# Altium schematic sheet phase-shifters.SchDoc
size 420 x 297 mm; SheetNumber: 3; SheetTotal: 7
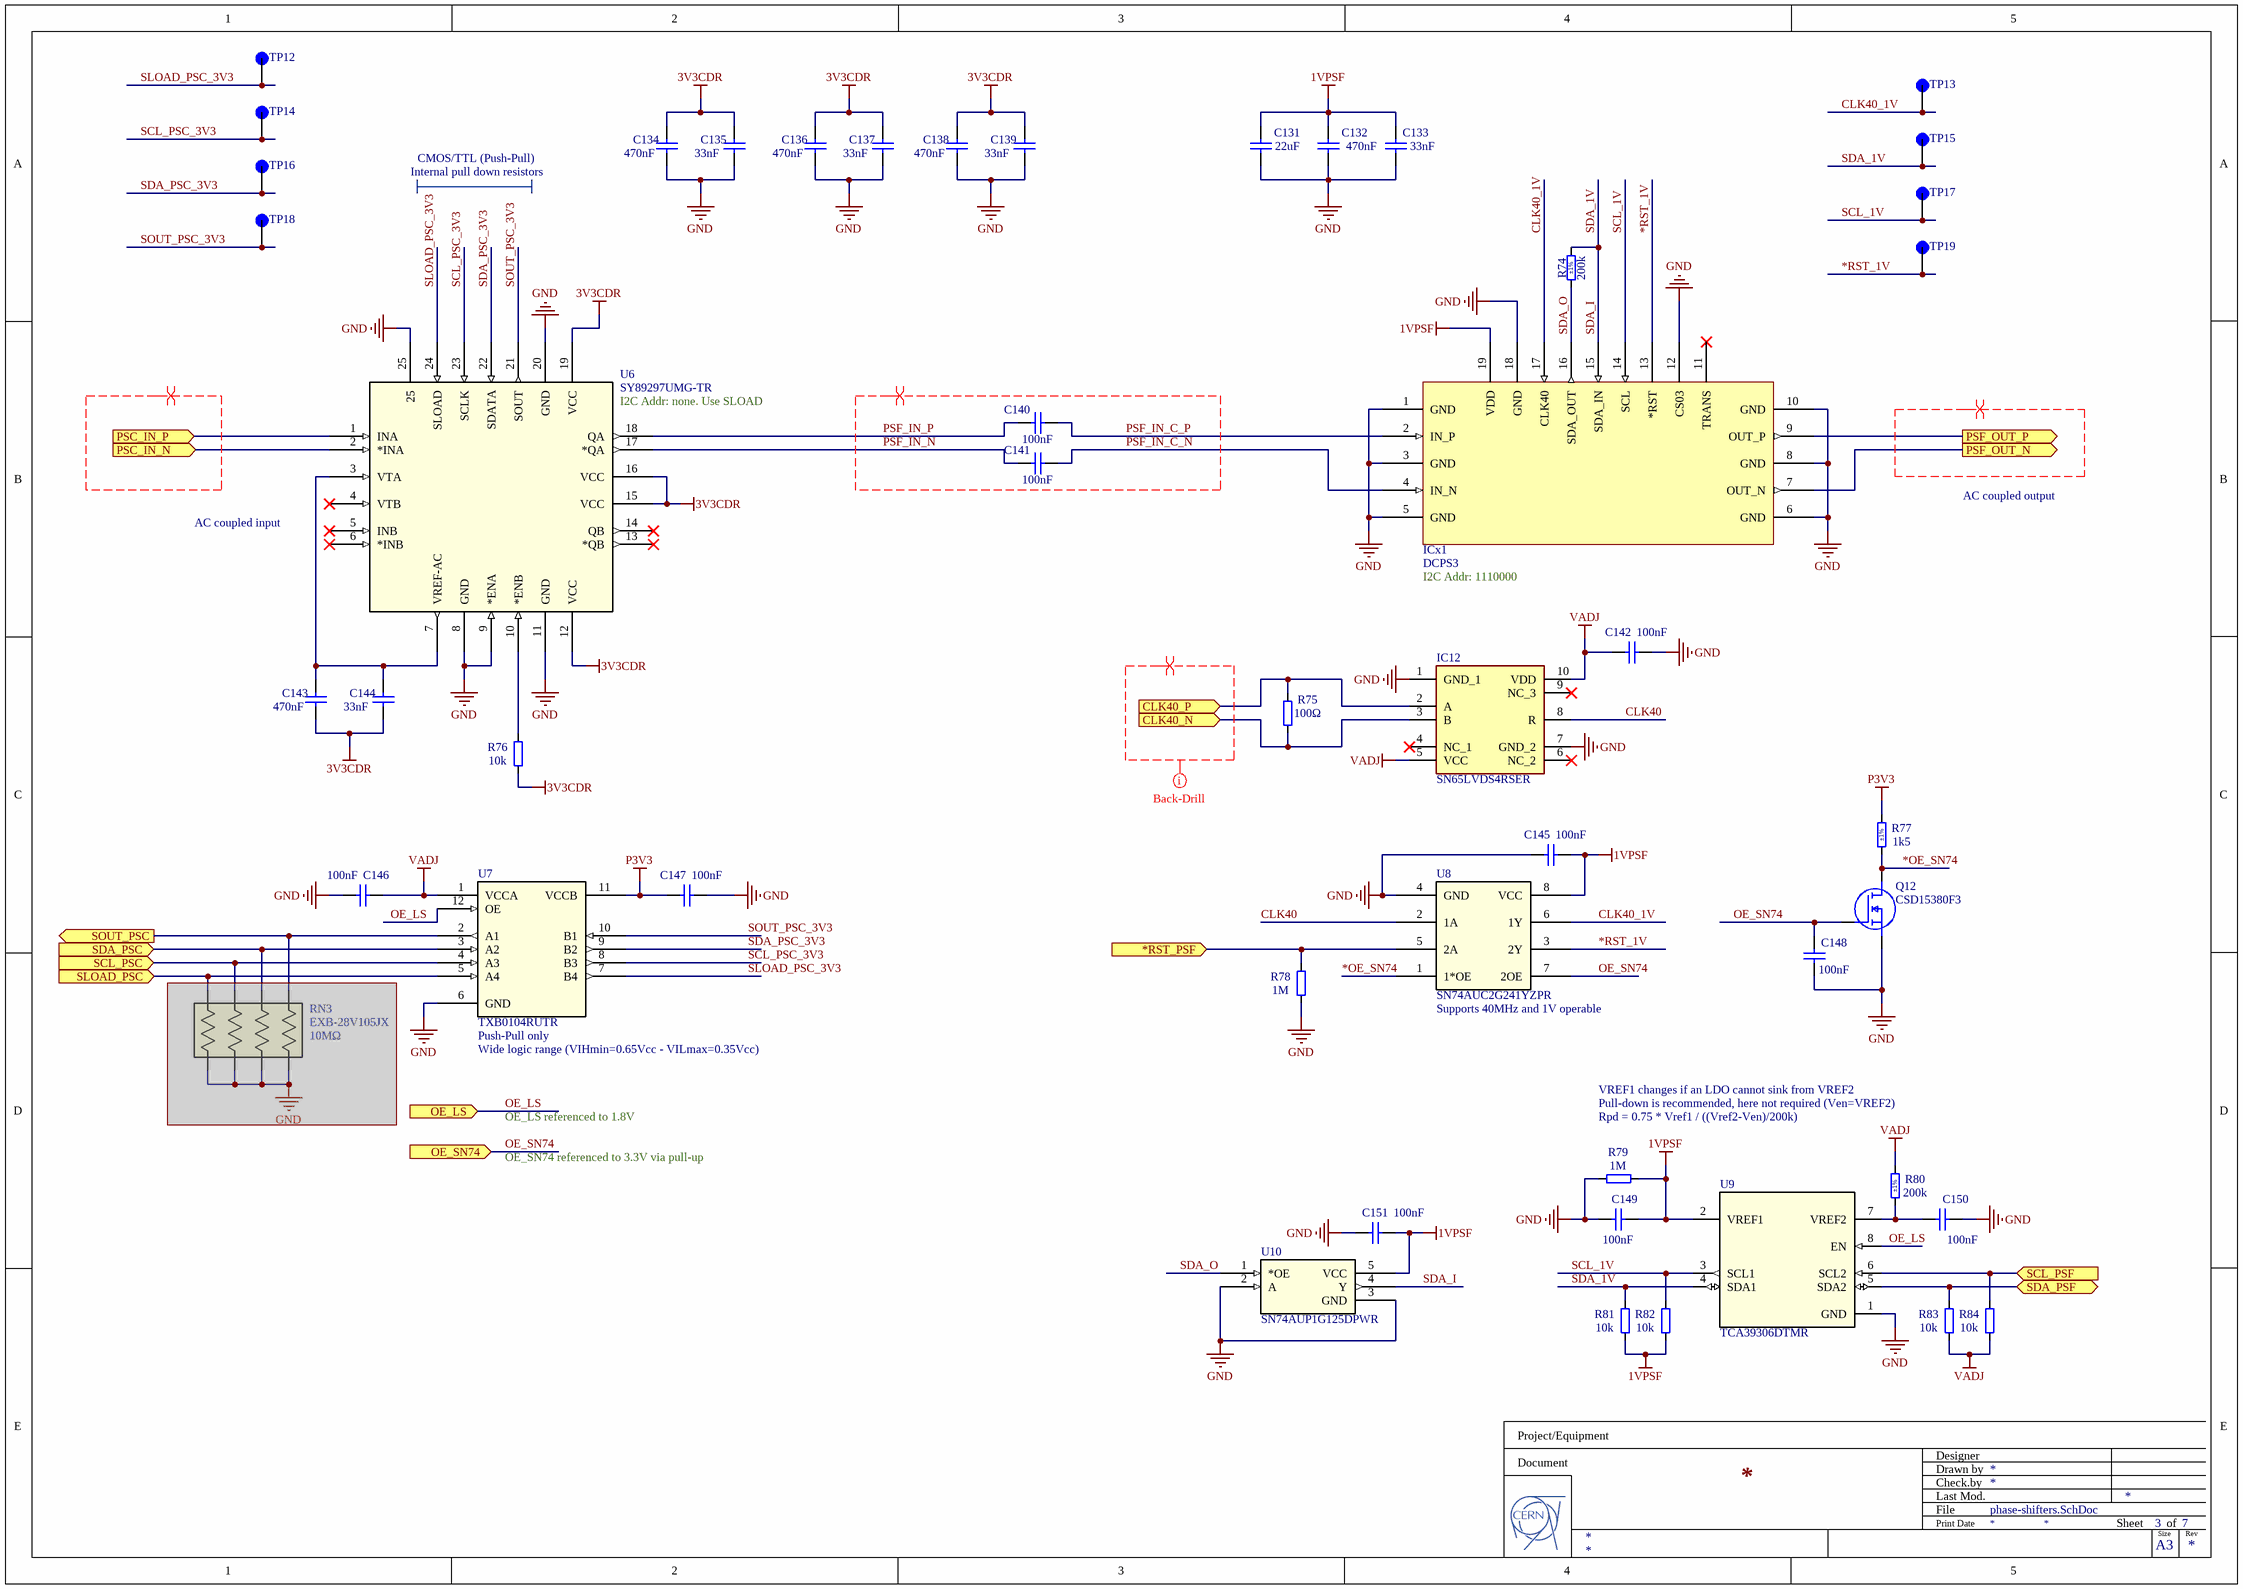
[diagram p0: phase-shifters.SchDoc]

## Parts
C131  22uF  [MURATA_HI_DENSITY_0402_CAP]
C132  470nF  [CAPC0510X04N]
C133  33nF  [LLL03TR61E333KE01]
C134  470nF  [CAPC0510X04N]
C135  33nF  [LLL03TR61E333KE01]
C136  470nF  [CAPC0510X04N]
C137  33nF  [LLL03TR61E333KE01]
C138  470nF  [CAPC0510X04N]
C139  33nF  [LLL03TR61E333KE01]
C140  100nF  [MURATA_HI_DENSITY_0201]
C141  100nF  [MURATA_HI_DENSITY_0201]
C142  100nF  [MURATA_HI_DENSITY_0201]
C143  470nF  [CAPC0510X04N]
C144  33nF  [LLL03TR61E333KE01]
C145  100nF  [MURATA_HI_DENSITY_0201]
C146  100nF  [MURATA_HI_DENSITY_0201]
C147  100nF  [MURATA_HI_DENSITY_0201]
C148  100nF  [MURATA_HI_DENSITY_0201]
C149  100nF  [MURATA_HI_DENSITY_0201]
C150  100nF  [MURATA_HI_DENSITY_0201]
C151  100nF  [MURATA_HI_DENSITY_0201]
IC12  SN65LVDS4RSER  [SN65LVDS4RSER]
ICx1  DCPS3  [DCPS3-Large]
Q12  CSD15380F3  [CSD15380F3]
R74  200k  Tolerance: ±1%  [RESC1005X40N]
R75  100Ω  [MURATA_HI_DENSITY_0201]
R76  10k  [MURATA_HI_DENSITY_0201]
R77  1k5  Tolerance: ±1%  [RESC1005X40N]
R78  1M  [MURATA_HI_DENSITY_0201]
R79  1M  [MURATA_HI_DENSITY_0201]
R80  200k  Tolerance: ±1%  [RESC1005X40N]
R81  10k  [MURATA_HI_DENSITY_0201]
R82  10k  [MURATA_HI_DENSITY_0201]
R83  10k  [MURATA_HI_DENSITY_0201]
R84  10k  [MURATA_HI_DENSITY_0201]
RN3  EXB-28V105JX  [EXB28V510JX]  (masked out: inside a compile mask, not in the netlist)
TP12  RCU-0C  [TP+195X110]  (value not drawn)
TP13  RCU-0C  [TP+195X110]  (value not drawn)
TP14  RCU-0C  [TP+195X110]  (value not drawn)
TP15  RCU-0C  [TP+195X110]  (value not drawn)
TP16  RCU-0C  [TP+195X110]  (value not drawn)
TP17  RCU-0C  [TP+195X110]  (value not drawn)
TP18  RCU-0C  [TP+195X110]  (value not drawn)
TP19  RCU-0C  [TP+195X110]  (value not drawn)
U6  SY89297UMG-TR  [QFN-24_MCH-L]
U7  TXB0104RUTR  [RUT12_TEX]
U8  SN74AUC2G241YZPR  [YZP8]
U9  TCA39306DTMR  [DTM0008A-MFG]
U10  SN74AUP1G125DPWR  [X2SON_TEX]

## Ports
*RST_PSF (in), CLK40_N (in), CLK40_P (in), OE_LS (in), OE_SN74 (in), PSC_IN_N (in), PSC_IN_P (in), PSF_OUT_N (out), PSF_OUT_P (out), SCL_PSC (in), SCL_PSF (in), SDA_PSC (in), SDA_PSF (bidir), SLOAD_PSC (in), SOUT_PSC (out)

## Nets
1VPSF: C131.2 C132.2 C133.2 C145.1 C149.1 C151.2 ICx1.19(VDD) R79.2 R81.1 R82.1 U8.8(VCC) U9.2(VREF1) U10.5(VCC)
3V3CDR: C134.2 C135.2 C136.2 C137.2 C138.2 C139.2 C143.1 C144.1 R76.1 U6.12(VCC) U6.15(VCC) U6.16(VCC) U6.19(VCC)
GND: C131.1 C132.1 C133.1 C134.1 C135.1 C136.1 C137.1 C138.1 C139.1 C142.1 C145.2 C146.1 C147.1 C148.2 C149.2 C150.1 C151.1 IC12.1(GND_1) IC12.7(GND_2) ICx1.1(GND) ICx1.3(GND) ICx1.5(GND) ICx1.6(GND) ICx1.8(GND) ICx1.10(GND) ICx1.12(CS03) ICx1.18(GND) Q12.2(S) R78.1 R79.1 U6.8(GND) U6.9(*ENA) U6.11(GND) U6.20(GND) U6.25 U7.6(GND) U8.4(GND) U9.1(GND) U10.2(A) U10.3(GND)
P3V3: C147.2 R77.2 U7.11(VCCB)
VADJ: C142.2 C146.2 IC12.5(VCC) IC12.10(VDD) R80.2 R83.1 R84.1 U7.1(VCCA)
*OE_SN74: Q12.3(D) R77.1 U8.1(1*OE)
*RST_1V: ICx1.13(*RST) TP19.1(TP) U8.3(2Y)
*RST_PSF: R78.2 U8.5(2A) ; port *RST_PSF
CLK40: IC12.8(R) U8.2(1A)
CLK40_1V: ICx1.17(CLK40) TP13.1(TP) U8.6(1Y)
CLK40_N: IC12.3(B) R75.1 ; port CLK40_N
CLK40_P: IC12.2(A) R75.2 ; port CLK40_P
OE_LS: U7.12(OE) U9.8(EN) ; port OE_LS
OE_SN74: C148.1 Q12.1(G) U8.7(2OE) ; port OE_SN74
PSC_IN_N: U6.2(*INA) ; port PSC_IN_N
PSC_IN_P: U6.1(INA) ; port PSC_IN_P
PSF_IN_C_N: C141.2 ICx1.4(IN_N)
PSF_IN_C_P: C140.2 ICx1.2(IN_P)
PSF_IN_N: C141.1 U6.17(*QA)
PSF_IN_P: C140.1 U6.18(QA)
PSF_OUT_N: ICx1.7(OUT_N) ; port PSF_OUT_N
PSF_OUT_P: ICx1.9(OUT_P) ; port PSF_OUT_P
SCL_1V: ICx1.14(SCL) R82.2 TP17.1(TP) U9.3(SCL1)
SCL_PSC: U7.4(A3) ; port SCL_PSC
SCL_PSC_3V3: TP14.1(TP) U6.23(SCLK) U7.8(B3)
SCL_PSF: R84.2 U9.6(SCL2) ; port SCL_PSF
SDA_1V: ICx1.15(SDA_IN) R74.2 R81.2 TP15.1(TP) U9.4(SDA1) U10.4(Y)  [also labelled SDA_I]
SDA_O: ICx1.16(SDA_OUT) R74.1 U10.1(*OE)
SDA_PSC: U7.3(A2) ; port SDA_PSC
SDA_PSC_3V3: TP16.1(TP) U6.22(SDATA) U7.9(B2)
SDA_PSF: R83.2 U9.5(SDA2) ; port SDA_PSF
SLOAD_PSC: U7.5(A4) ; port SLOAD_PSC
SLOAD_PSC_3V3: TP12.1(TP) U6.24(SLOAD) U7.7(B4)
SOUT_PSC: U7.2(A1) ; port SOUT_PSC
SOUT_PSC_3V3: TP18.1(TP) U6.21(SOUT) U7.10(B1)
NetC143_2: C143.2 C144.2 U6.3(VTA) U6.7(VREF-AC)
NetC150_2: C150.2 R80.1 U9.7(VREF2)
NetR76_2: R76.2 U6.10(*ENB)

Not connected (* = marked no-connect by the designer): IC12 4(NC_1)* 6(NC_2)* 9(NC_3)*; ICx1 11(TRANS)*; U6 4(VTB)* 5(INB)* 6(*INB)* 13(*QB)* 14(QB)*

## Layout directives
differential pair: (no net found under the mark), PSF_IN_C_N, PSF_IN_C_P, PSF_IN_N, PSF_IN_P
net class Back-Drill: (no net found under the mark)

## Notes on the sheet
- Internal pull down resistors
- CMOS/TTL (Push-Pull)
- (near U6) I2C Addr: none. Use SLOAD
- AC coupled input
- AC coupled output
- I2C Addr: 1110000
- (near RN3) 10MΩ
- (near U7) Push-Pull only
- (near U7) Wide logic range (VIHmin=0.65Vcc - VILmax=0.35Vcc)
- (near U8) Supports 40MHz and 1V operable
- OE_LS referenced to 1.8V
- Rpd = 0.75 * Vref1 / ((Vref2-Ven)/200k)
- VREF1 changes if an LDO cannot sink from VREF2
- Pull-down is recommended, here not required (Ven=VREF2)
- OE_SN74 referenced to 3.3V via pull-up
- Project/Equipment
- Document
- Designer
- Drawn by
- Check.by
- File
- Last Mod.
- Print Date
- Sheet
- Size
- A3
- of
- Rev

## Library data of the parts
C131 = C0402-22uF-high-density: GRM155R60J226ME11; Vmax: 6.3V; Value: 22uF
C132 C134 C136 C138 C143 = Capacitor - non polarized: LLL153C70G474ME17; Value: 470nF
C133 C135 C137 C139 C144 = Capacitor - non polarized: LLL03TR61E333KE01; Value: 33nF
C140-C142 C145-C151 = C0201-100nF-high-density: GRM033R61C104KE14; Vmax: 16V; Value: 100nF
IC12 = SN65LVDS4RSER: Integrated Circuit; Manufacturer_Name: Texas Instruments; Datasheet Link: http://www.ti.com/lit/gpn/SN65LVDS4; Height: 0.6mm; Manufacturer_Part_Number: SN65LVDS4RSER; Mouser Part Number: 595-SN65LVDS4RSER; Mouser Price/Stock: https://www.mouser.co.uk/ProductDetail/Texas-Instruments/SN65LVDS4RSER?qs=kO%2FAGeZgcF8xT3dfx7gx%252Bg%3D%3D; Arrow Part Number: SN65LVDS4RSER; Arrow Price/Stock: https://www.arrow.com/en/products/sn65lvds4rser/texas-instruments
Q12 = CSD15380F3: MOSFET (N-Channel); Manufacturer_Name: Texas Instruments; Datasheet Link: https://www.ti.com/lit/ds/symlink/csd15380f3.pdf?ts=1641221366106&ref_url=https%253A%252F%252Fwww.google.com%252F; Height: 0.35mm; Manufacturer_Part_Number: CSD15380F3; Mouser Part Number: 595-CSD15380F3; Mouser Price/Stock: https://www.mouser.co.uk/ProductDetail/Texas-Instruments/CSD15380F3?qs=zEmsApcVOkXP46xhm0edmA%3D%3D; Arrow Part Number: CSD15380F3; Arrow Price/Stock: https://www.arrow.com/en/products/csd15380f3/texas-instruments?region=nac
R74 R80 = R0402_200K_1%_0.0625W_100PPM: Resistor - 1%; Part Description: General Purpose Thick Film Chip Resistor; Manufacturer: GENERIC; Manufacturer1 Part Number: 232270672004L; TC: ±100ppm/°C; PressFit: No; Part Number: R0402_200K_1%_0.0625W_100PPM; Component Kind: Standard; Component Type: Standard; Pin Count: 2; Value: 200k; Status: Not Recommended; Power: 0.0625W; Manufacturer Part Number: R0402_200K_1%_0.0625W_100PPM; Case: 0402; Mounted: Yes; Sense: No; Socket: No; SMD: Yes; Manufacturer1 Example: YAGEO PHYCOMP; Manufacturer1 ComponentHeight: 0.4mm; HelpURL: \\cern.ch\dfs\Applications\Altium\Datasheets\R0402_Phycomp_RC0402.pdf; Author: CERN DEM JLC; CreateDate: 12/3/2007; LatestRevisionDate: 10/17/2012
R75 = R0201-100ohm-high-density: Resistor; Value: 100Ω
R76 R81-R84 = R0201-100ohm-high-density: Resistor 10k; Value: 100Ω
R77 = R0402_1K5_1%_0.0625W_100PPM: Resistor - 1%; Part Description: General Purpose Thick Film Chip Resistor; Manufacturer: GENERIC; Manufacturer1 Part Number: 232270671502L; TC: ±100ppm/°C; PressFit: No; Part Number: R0402_1K5_1%_0.0625W_100PPM; Component Kind: Standard; Component Type: Standard; Pin Count: 2; Value: 1k5; Status: Not Recommended; Power: 0.0625W; Manufacturer Part Number: R0402_1K5_1%_0.0625W_100PPM; Case: 0402; Mounted: Yes; Sense: No; Socket: No; SMD: Yes; Manufacturer1 Example: YAGEO PHYCOMP; Manufacturer1 ComponentHeight: 0.4mm; HelpURL: \\cern.ch\dfs\Applications\Altium\Datasheets\R0402_Phycomp_RC0402.pdf; Author: CERN DEM JLC; CreateDate: 12/3/2007; LatestRevisionDate: 10/17/2012
R78 R79 = R0201-100ohm-high-density: Resistor 1M; Value: 100Ω
RN3 = EXB-28V105JX: Resistor Network; Manufacturer_Name: Panasonic; Datasheet Link: https://componentsearchengine.com/Datasheets/1/EXB-28V105JX.pdf; Height: 0mm; Manufacturer_Part_Number: EXB-28V105JX; Mouser Part Number: 667-EXB-28V105JX; Mouser Price/Stock: https://www.mouser.co.uk/ProductDetail/Panasonic/EXB-28V105JX?qs=cttFivMKqWzpuYBrjCbkjA%3D%3D; Arrow Part Number: EXB-28V105JX; Arrow Price/Stock: https://www.arrow.com/en/products/exb-28v105jx/panasonic
TP12-TP19 = RCU-0C: MF: {'manufacturer': u'TE Connectivity AMP Connectors'}; Package: None; Price: None; Value: *; MP: RCU-0C; Availability: Unavailable
U6 = SY89297UMG-TR: Coarse Phase Shifter (5ps/5ns); Mfr_Name: Microchip; RefDes: RefDes; Type: Type
U7 = TXB0104RUTR: No Description Available; Mfr_Name: Texas Instruments; RefDes: RefDes; Type: Type
U8 = SN74AUC2G241YZPR: No Description Available; Mfr_Name: Texas Instruments; RefDes: RefDes; Type: Type
U9 = TCA39306DTMR: No Description Available; Mfr_Name: Texas Instruments; TYPE: TYPE; RefDes: RefDes
U10 = SN74AUP1G125DPWR: No Description Available; Mfr_Name: Texas Instruments; RefDes: RefDes; Type: Type